# EAGLE design OMHT6 (EAGLE 5.11)
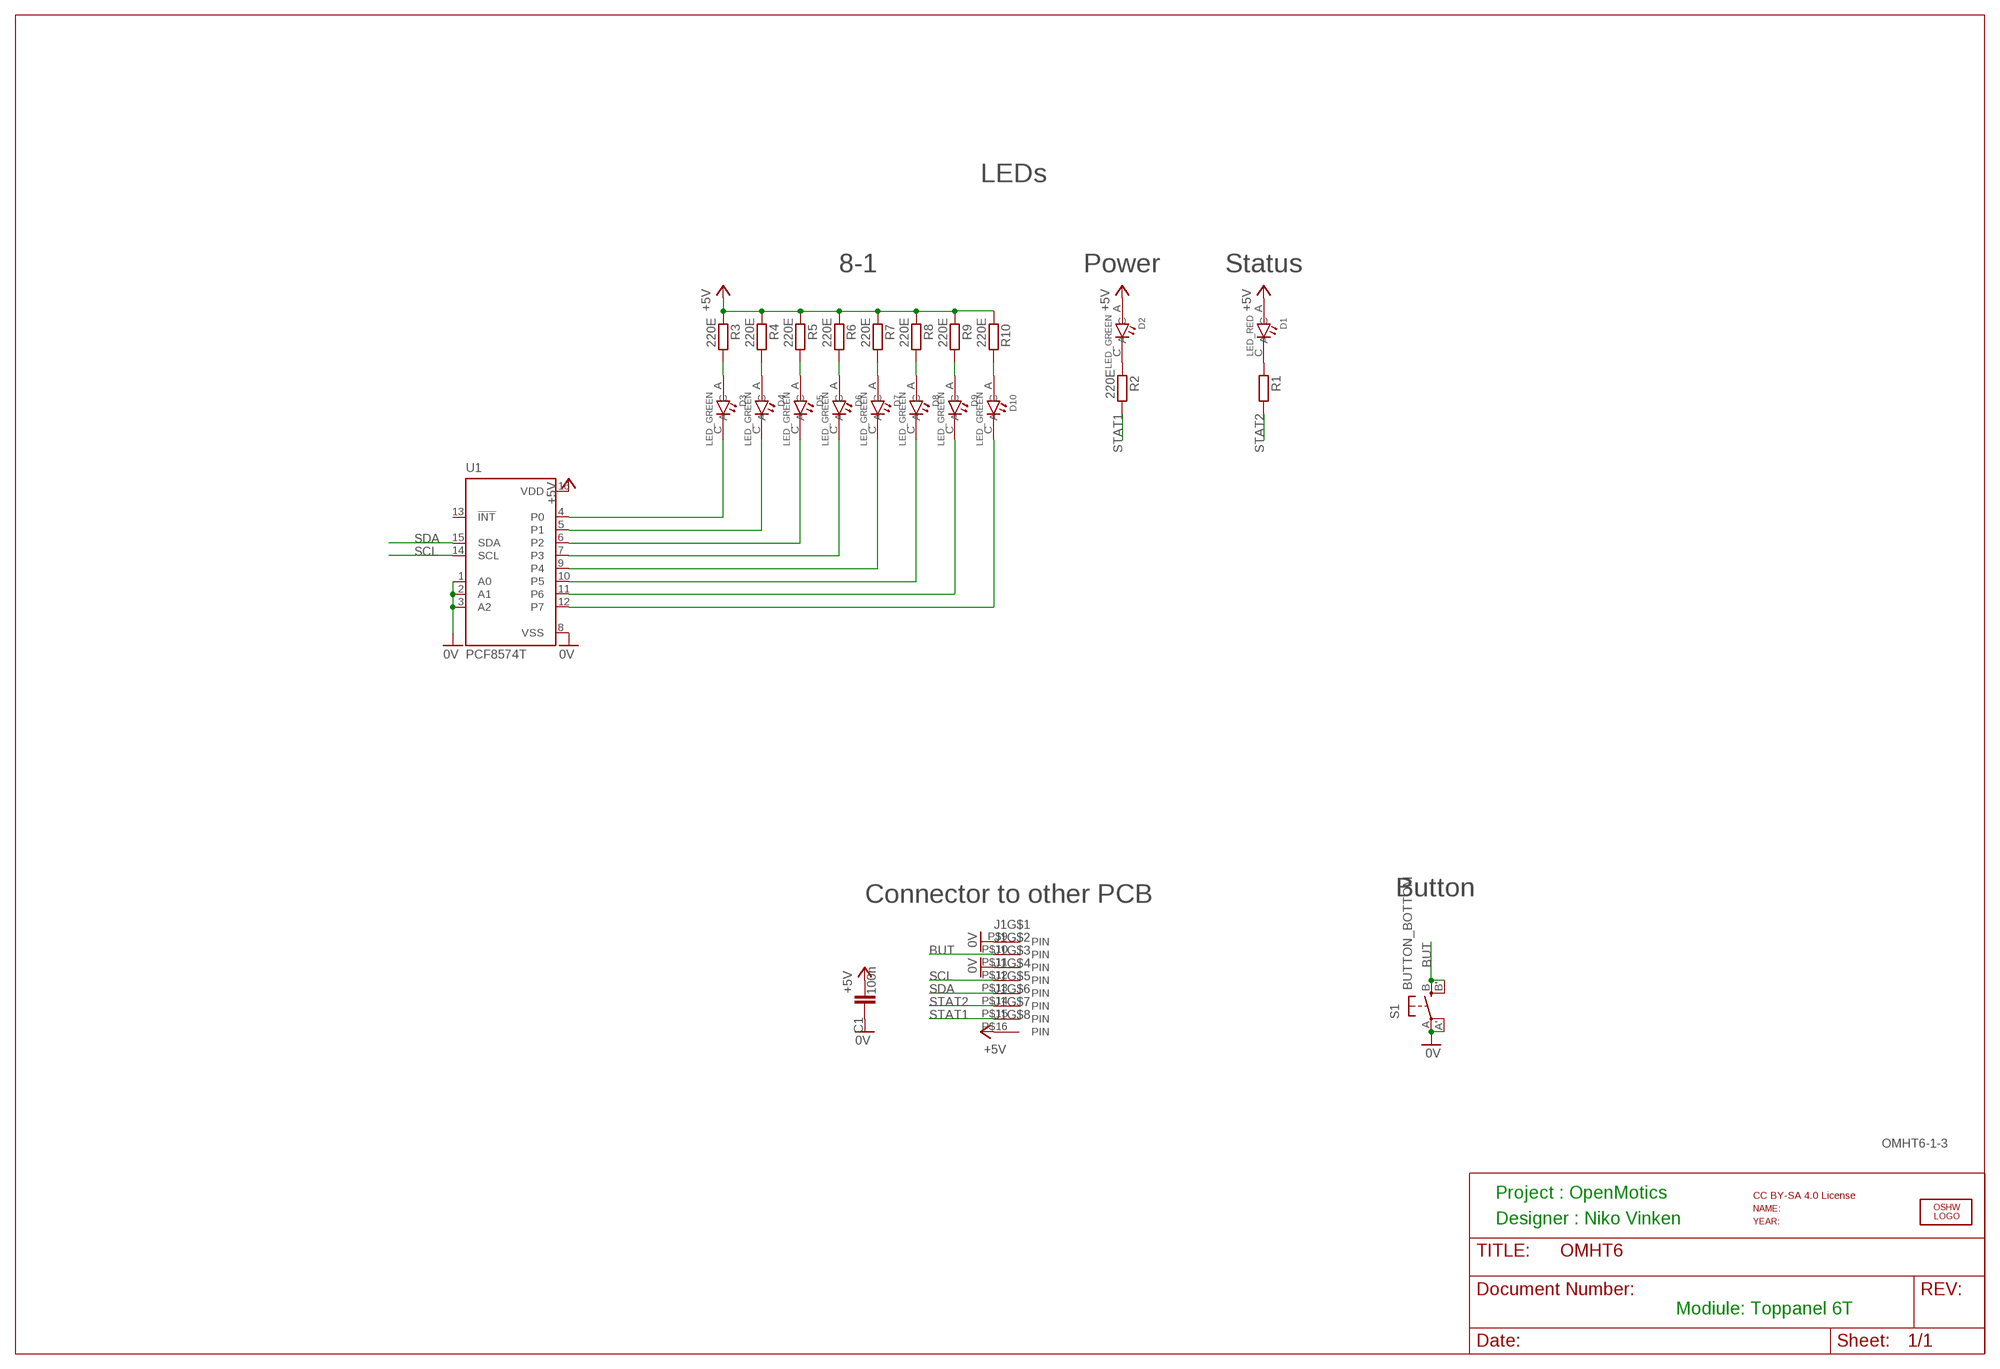
[diagram p0: schematic, sheet 1]

## Parts
C1  100n  C-EUC0603  [C0603]
D1  LED_RED  LED  [LED_BOTTOM]
D2  LED_GREEN  LED  [LED_BOTTOM]
D3  LED_GREEN  LED  [LED_BOTTOM]
D4  LED_GREEN  LED  [LED_BOTTOM]
D5  LED_GREEN  LED  [LED_BOTTOM]
D6  LED_GREEN  LED  [LED_BOTTOM]
D7  LED_GREEN  LED  [LED_BOTTOM]
D8  LED_GREEN  LED  [LED_BOTTOM]
D9  LED_GREEN  LED  [LED_BOTTOM]
D10  LED_GREEN  LED  [LED_BOTTOM]
J1  8PIN_CON_AMPSMD  [8PIN_CON_AMP_SMD]
LOGO2  OSHW_LOGO_FILLX0150-NT  [OSHW_FILLX150_NOTEXT]
OMHT6-1-3  LOGO_PCB  [LOGO_10MM]
R1  1K5  R-EU_R0603  [R0603]
R2  220E  R-EU_R0603  [R0603]
R3  220E  R-EU_R0603  [R0603]
R4  220E  R-EU_R0603  [R0603]
R5  220E  R-EU_R0603  [R0603]
R6  220E  R-EU_R0603  [R0603]
R7  220E  R-EU_R0603  [R0603]
R8  220E  R-EU_R0603  [R0603]
R9  220E  R-EU_R0603  [R0603]
R10  220E  R-EU_R0603  [R0603]
S1  BUTTON_BOTTOM  [BUTTON_BOTTOM]
U1  PCF8574T  [SO16W]
U$5  CC_BY_SA  [CC_BY_SA]

## Nets
0V: C1.2 J1.P$9 J1.P$11 S1.A'(P1) S1.A(P) U1.1(A0) U1.2(A1) U1.3(A2) U1.8(VSS)
+5V: C1.1 D1.A D2.A J1.P$16 R3.1 R4.1 R5.1 R6.1 R7.1 R8.1 R9.1 R10.1 U1.16(VDD)
BUT: J1.P$10 S1.B'(S1) S1.B(S)
N$1: D2.C R2.1
N$2: D1.C R1.1
N$3: D3.A R3.2
N$4: D4.A R4.2
N$5: D5.A R5.2
N$6: D8.C U1.10(P5)
N$7: D7.C U1.9(P4)
N$8: D6.C U1.7(P3)
N$9: D5.C U1.6(P2)
N$10: D4.C U1.5(P1)
N$11: D3.C U1.4(P0)
N$12: D6.A R6.2
N$13: D7.A R7.2
N$14: D8.A R8.2
N$15: D9.A R9.2
N$16: D10.A R10.2
N$34: D10.C U1.12(P7)
N$60: D9.C U1.11(P6)
SCL: J1.P$12 U1.14(SCL)
SDA: J1.P$13 U1.15(SDA)
STAT1: J1.P$15 R2.2
STAT2: J1.P$14 R1.2
Unconnected: U1.13(!INT)

## Notes on the sheet
- LEDs
- 8-1 | Power | Status
- Connector to other PCB | Button
- Project : OpenMotics
- Designer : Niko Vinken
- Modiule: Toppanel 6T

## Library data of the parts
C1 = resistor:C-EU: CAPACITOR, European symbol
D1-D10 = OpenMotics:LED
J1 = OpenMotics:8PIN_CON_AMP
LOGO2 = ohw-logo:OSHW_LOGO_FILL
OMHT6-1-3 = OpenMotics:LOGO_PCB
R1-R10 = rcl:R-EU_: RESISTOR, European symbol
S1 = OpenMotics:BUTTON_BOTTOM
U1 = micro-philips:PCF8574: I2C-Bus Remote 8-bit I/O expander http://www.semiconductors.philips.com/acrobat_download/datasheets/PCF8574_4.pdf; MPN: PCF8574T/3,512; OC_FARNELL: 1201255; OC_NEWARK: 70R6870
U$5 = OpenMotics:CC_BY_SA

## Board
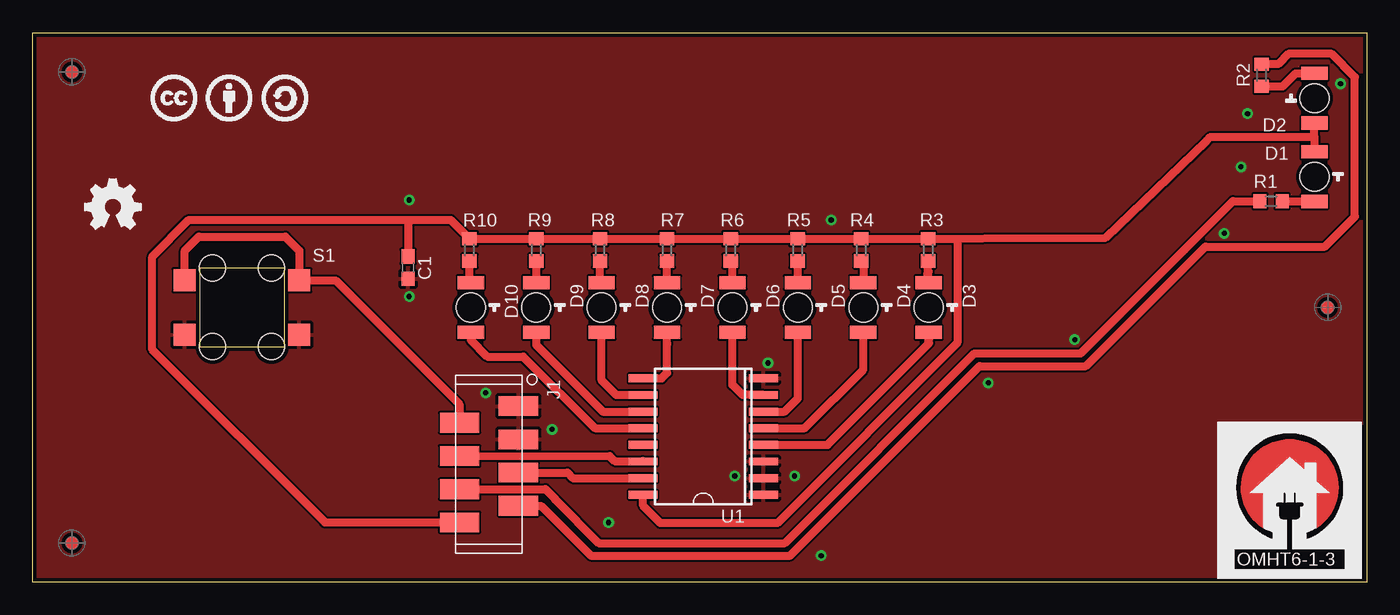
[diagram p1: board, top side]
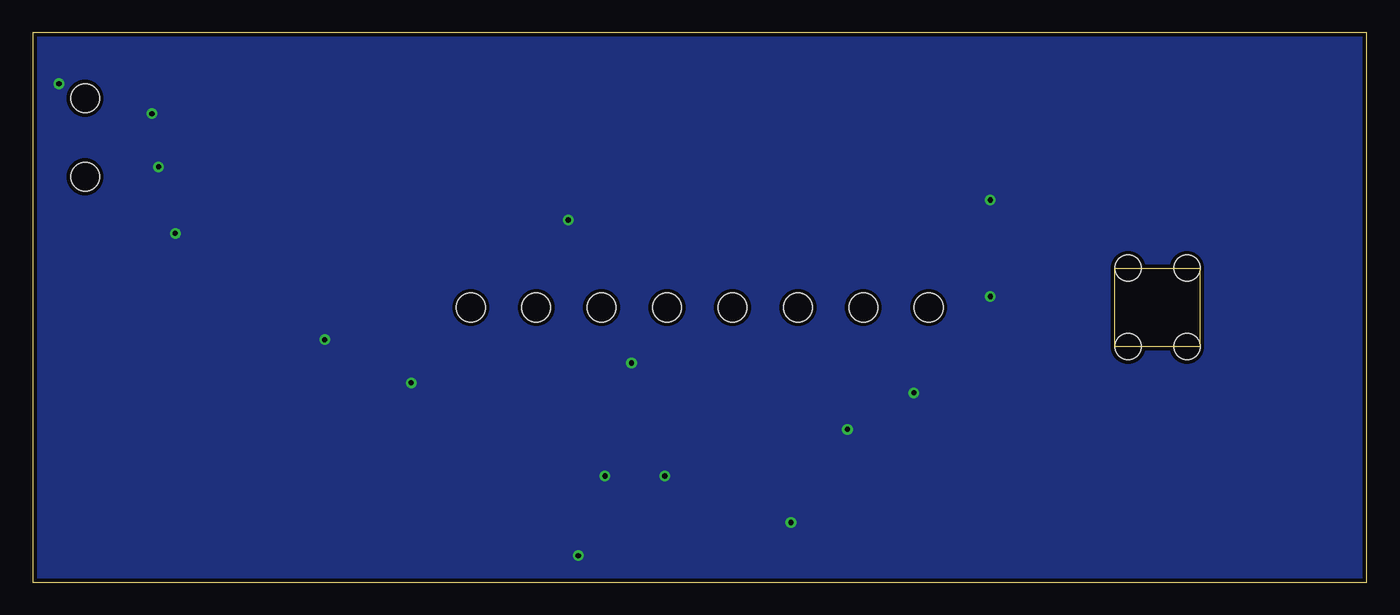
[diagram p2: board, bottom side, seen from below]

Size 102 x 42 mm. Coordinates in mm from the lower left corner, seen from the top.
Outline: 102,0 0,0 0,42 102,42 102,0
Copper layers (1+16): Top 0.035mm / dielectric 1.5mm / Bottom 0.035mm
Design rules "default *": minimum track width 10mil, minimum drill 24mil, track to track 6mil, track to pad 6mil, pad to pad 6mil, via to via 6mil, smd to smd 6mil, copper to edge 12mil, drill to drill 8mil, minimum pad ring 10mil, minimum via ring 8mil, stop-mask expansion 4mil, vias tented up to drill 16mil, thermal gap 10mil

### Footprints (pad centres in the part's own frame; a part is rotated, then mirrored left to right if it is on the bottom)
C0603 = smd 1.1 x 1: 1 -0.85,0; 2 0.85,0
LED_BOTTOM = smd 1 x 2: A -1.9,0; C 1.9,0 | hole 2.2: 0,0
8PIN_CON_AMP_SMD = smd 1.5 x 3: P$9 0,2.25; P$10 1.27,-2.25; P$11 2.54,2.25; P$12 3.81,-2.25; P$13 5.08,2.25; P$14 6.35,-2.25; P$15 7.62,2.25; P$16 8.89,-2.25
R0603 = smd 1 x 1.1: 1 -0.85,0; 2 0.85,0
BUTTON_BOTTOM = smd 1.7 x 1.7: A -4.375,-2.075; A' 4.375,-2.075; B -4.375,2.075; B' 4.375,2.075 | hole 2: -2.25,3; 2.25,3; -2.25,-3; 2.25,-3
SO16W = smd 0.6 x 2.2: 1 -4.445,-4.6; 2 -3.175,-4.6; 3 -1.905,-4.6; 4 -0.635,-4.6; 5 0.635,-4.6; 6 1.905,-4.6; 7 3.175,-4.6; 8 4.445,-4.6; 9 4.445,4.6; 10 3.175,4.6; 11 1.905,4.6; 12 0.635,4.6; 13 -0.635,4.6; 14 -1.905,4.6; 15 -3.175,4.6; 16 -4.445,4.6

### Placement (x,y rotation side)
C1  28.7,24.05 270 top
D1  98,31 270 top
D2  98,37 90 top
D3  68.5,21 270 top
D4  63.5,21 270 top
D5  58.5,21 270 top
D6  53.5,21 270 top
D7  48.5,21 270 top
D8  43.5,21 270 top
D9  38.5,21 270 top
D10  33.5,21 270 top
J1  34.88,13.46 270 top
LOGO2  4,27 0 top
OMHT6-1-3  90.59,0.25 0 top
R1  94.68,29.12 180 top
R2  93.95,38.75 90 top
R3  68.47,25.4 270 top
R4  63.35,25.4 270 top
R5  58.48,25.4 270 top
R6  53.36,25.4 270 top
R7  48.49,25.4 270 top
R8  43.37,25.4 270 top
R9  38.51,25.4 270 top
R10  33.39,25.4 270 top
S1  16,21 0 top
U1  51.27,11.14 90 top
U$1  [FIDUCIAL_G10]  99,21 0 top
U$2  [FIDUCIAL_G10]  3,3 0 top
U$3  [FIDUCIAL_G10]  3,39 0 top
U$5  15,37 0 top

### Tracks (layer width: path | path; a pad name or v marks a point on that pad's centre or on a via)
0V  (via drill 0.4)
  other vias: 56.22,16.76 58.25,8.13 53.68,8.13 44.03,4.57 39.71,11.68 34.63,14.48 60.28,2.03 92.88,35.81 61.04,27.69 28.79,29.21 28.79,21.84 99.99,38.1 91.1,26.67 92.37,31.75 79.67,18.54 73.07,15.24
  pour Top: 0,0 90.68,0.25 90.68,9.21 93.64,12.18 101.77,12.18 101.85,41.91 0,41.91
  pour Bottom: 0,0 101.85,0 101.85,41.91 0,41.91
+5V
  Top 0.61: R4.1 R5.1 R6.1 R7.1 R8.1 R9.1 R10.1 31.95,27.69 28.96,27.69 | R4.1 R3.1 70.61,26.25 70.7,26.16 70.7,18.29 56.92,4.52 48,4.52 46.67,5.85 U1.16 | R4.1 82.05,26.35 89.75,33.75 90.04,34.04 98,34.04 | J1.P$16 22.35,4.57 9.14,17.78 9.14,24.89 11.94,27.69 28.96,27.69 | C1.1 28.7,27.43 28.96,27.69 | 98,34.04 D1.A | 98,34.04 D2.A
BUT
  Top 0.61: J1.P$10 32.63,13.6 23.15,23.07 S1.B' 20.38,25.34 19.3,26.42 12.7,26.42 11.62,25.34 S1.B
N$1
  Top 0.61: R2.1 95.56,37.9 96.56,38.9 D2.C
N$2
  Top 0.61: R1.1 95.55,29.1 D1.C
N$3
  Top 0.61: R3.2 68.41,23.37 68.38,23.37 68.5,23.75 D3.A
N$4
  Top 0.61: R4.2 63.5,24.4 D4.A
N$5
  Top 0.61: R5.2 58.5,24.53 D5.A
N$6
  Top 0.61: U1.10 44.62,14.31 43.5,15.43 D8.C
N$7
  Top 0.61: U1.9 48.09,15.58 48.51,16 48.51,18.22 48.5,18.23 D7.C
N$8
  Top 0.61: U1.7 54.27,14.31 53.5,15.08 D6.C
N$9
  Top 0.61: U1.6 57.49,13.04 58.5,14.05 D5.C
N$10
  Top 0.61: U1.5 59.02,11.77 63.5,16.26 D4.C
N$11
  Top 0.61: U1.4 60.77,10.5 68.53,18.27 68.51,18.77 68.5,18.25 D3.C
N$12
  Top 0.61: R6.2 53.5,24.41 D6.A
N$13
  Top 0.61: R7.2 D7.A
N$14
  Top 0.61: D8.A 43.37,23.03 R8.2
N$15
  Top 0.61: D9.A R9.2
N$16
  Top 0.61: D10.A 33.39,23.01 R10.2
N$34
  Top 0.61: U1.12 42.98,11.77 37.5,17.25 34.75,17.25 33.5,18.5 D10.C
N$60
  Top 0.61: U1.11 43.6,13.04 38.5,18.14 D9.C
SCL
  Top 0.61: J1.P$12 44.11,9.64 44.5,9.25 46.65,9.25 U1.14
SDA
  Top 0.61: U1.15 41.29,7.96 40.88,8.37 J1.P$13
STAT1
  Top 0.61: J1.P$15 38.86,5.84 42.67,2.03 57.91,2.03 72.39,16.51 80.52,16.51 89.66,25.65 98.81,25.65 101.09,27.94 101.09,38.61 99.31,40.39 96.01,40.39 95.23,39.6 R2.2
STAT2
  Top 0.61: J1.P$14 39.2,7.11 39.96,6.35 39.96,6.29 43.26,2.99 57.5,2.99 72,17.5 80.13,17.49 88.05,25.4 91.77,29.12 R1.2